# Altium schematic sheet Sensors.SchDoc: Science Sensor: Sensors
size Letter; Author: Emela M.; Organization: Husky Robotics; Address1: University of Washington; Address2: Mechanical Engineering; Address3: Seattle, WA; Revision: A; SheetNumber: 5; SheetTotal: 6
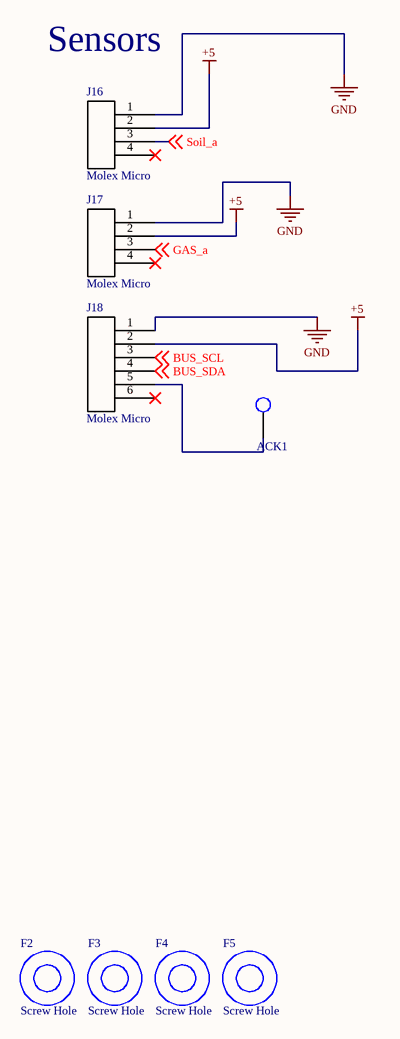
[diagram p0: Sensors.SchDoc]

## Parts
ACK1  Test Point  [Test Point Through-hole]  (value not drawn)
F2  Screw Hole  [Screw Hole]
F3  Screw Hole  [Screw Hole]
F4  Screw Hole  [Screw Hole]
F5  Screw Hole  [Screw Hole]
J16  Molex Micro  [MICROFIT R/A 4 PIN]
J17  Molex Micro  [MICROFIT R/A 4 PIN]
J18  Molex Micro  [MICROFIT R/A 6 PIN]

## Nets
+5: J16.2 J17.2 J18.2
GND: J16.1 J17.1 J18.1
BUS_SCL: J18.3 ; off-sheet BUS_SCL
BUS_SDA: J18.4 ; off-sheet BUS_SDA
GAS_a: J17.3 ; off-sheet GAS_a
Soil_a: J16.3 ; off-sheet Soil_a
NetACK1_1: ACK1.1 J18.5

Not connected (* = marked no-connect by the designer): J16 4*; J17 4*; J18 6*

## Notes on the sheet
- Sensors
- Title
- Size:
- Date:
- A
- Author:
- Revision:
- Sheet
- of
- File:

## Library data of the parts
F2-F5 = Screw Hole: Add 4 of these to your design for screw hole mounting
J16 J17 = Molex micro-fit 4-pin (Single row schematic): Molex micro-fit 3.0 dual row header. P/N 0430450427
J18 = Molex micro-fit 6-pin (single row schematic): Molex micro-fit 3.0 dual row connector. P/N 0430450627